# Altium schematic sheet BMduino_test.SchDoc
size A4; SheetNumber: 1; SheetTotal: 1
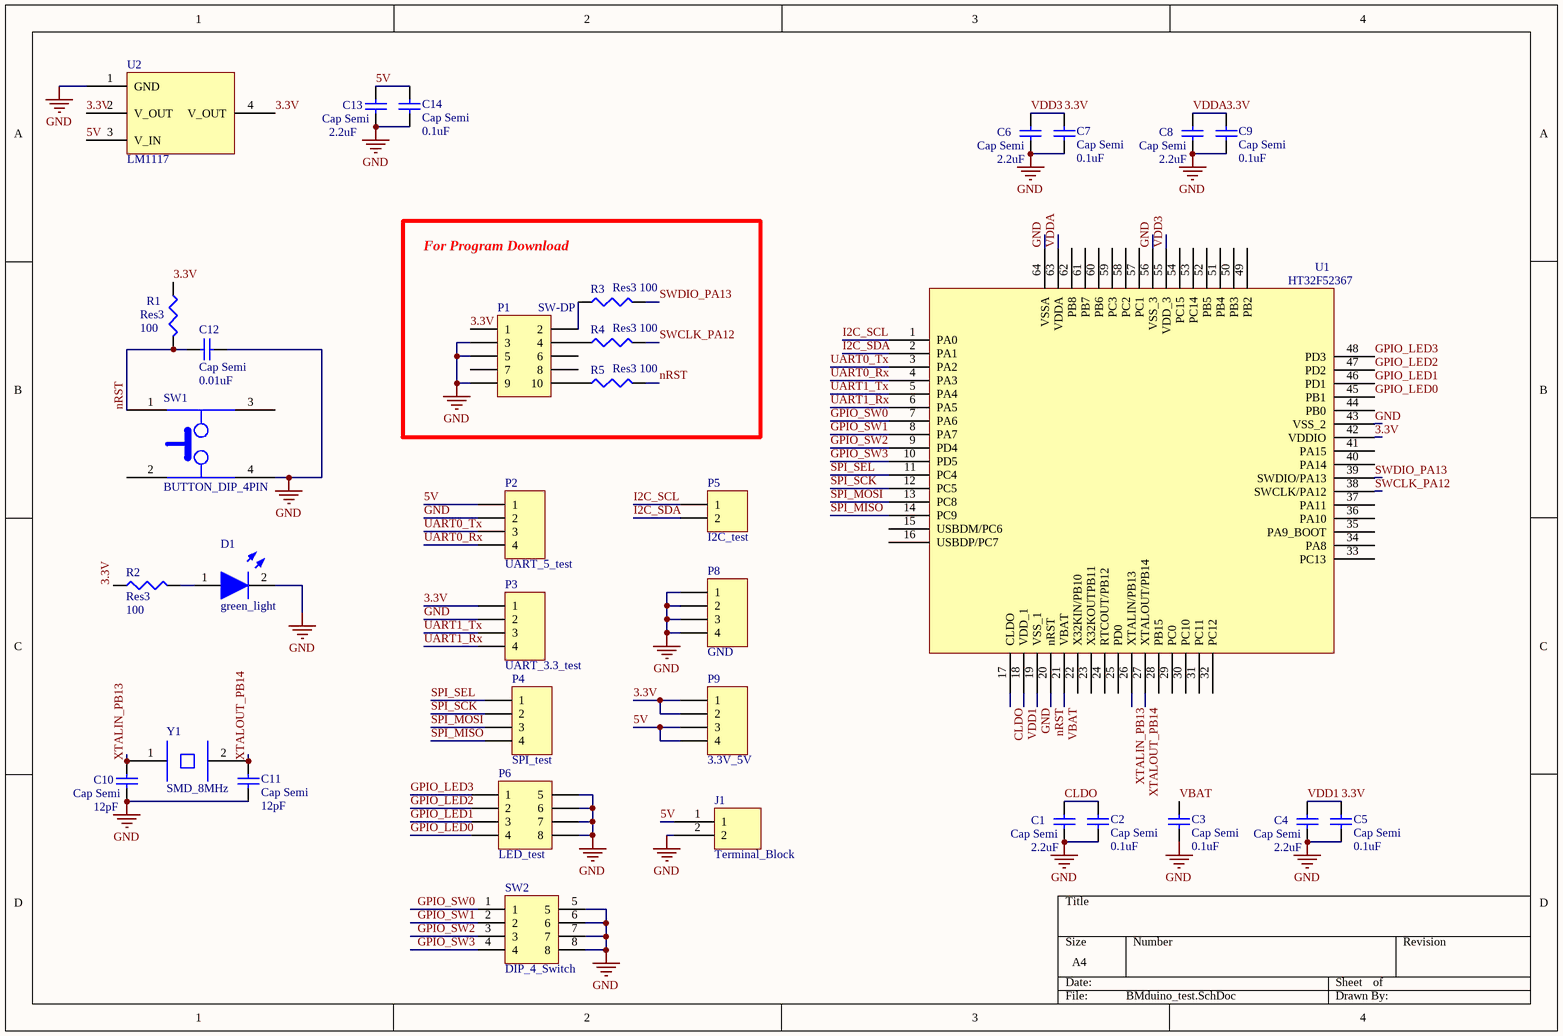
[diagram p0: BMduino_test.SchDoc]

## Parts
C1  Cap Semi  value 2.2uF  [1608[0603]]
C2  Cap Semi  value 0.1uF  [1608[0603]]
C3  Cap Semi  value 0.1uF  [1608[0603]]
C4  Cap Semi  value 2.2uF  [1608[0603]]
C5  Cap Semi  value 0.1uF  [1608[0603]]
C6  Cap Semi  value 2.2uF  [1608[0603]]
C7  Cap Semi  value 0.1uF  [1608[0603]]
C8  Cap Semi  value 2.2uF  [1608[0603]]
C9  Cap Semi  value 0.1uF  [1608[0603]]
C10  Cap Semi  value 12pF  [1608[0603]]
C11  Cap Semi  value 12pF  [1608[0603]]
C12  Cap Semi  value 0.01uF  [1608[0603]]
C13  Cap Semi  value 2.2uF  [1608[0603]]
C14  Cap Semi  value 0.1uF  [1608[0603]]
D1  green_light  [LED_Green]
J1  Terminal_Block  [terminal block]
P1  SW-DP  [HDR2X5]
P2  UART_5_test  [HDR1X4]
P3  UART_3.3_test  [HDR1X4]
P4  SPI_test  [HDR1X4]
P5  I2C_test  [HDR1X2]
P6  LED_test  [HDR2X4_CEN]
P8  GND  [HDR1X4]
P9  3.3V_5V  [HDR1X4]
R1  Res3  value 100  [J1-0603]
R2  Res3  value 100  [J1-0603]
R3  Res3  value 100  [J1-0603]
R4  Res3  value 100  [J1-0603]
R5  Res3  value 100  [J1-0603]
SW1  BUTTON_DIP_4PIN  [Push_Button]
SW2  DIP_4_Switch  [Switch_4]
U1  HT32F52367  [HT32H52367]
U2  LM1117  [LM1117 - duplicate]
Y1  SMD_8MHz  [Quartz-Crystal-8MHz]

## Blocks framed on the sheet
For Program Download: P1 R3-R5

## Nets
GND: C1.2 C2.1 C3.1 C4.2 C5.1 C6.2 C7.1 C8.2 C9.1 C10.2 C11.1 C12.1 C13.2 C14.1 D1.2 J1.2 P1.3 P1.5 P1.9 P2.2 P3.2 P6.5 P6.6 P6.7 P6.8 P8.1 P8.2 P8.3 P8.4 SW1.4 SW2.5 SW2.6 SW2.7 SW2.8 U1.19(VSS_1) U1.43(VSS_2) U1.56(VSS_3) U1.64(VSSA) U2.1(GND)
3.3V: C4.1 C5.2 C6.1 C7.2 C8.1 C9.2 P1.1 P3.1 P9.1 P9.2 R1.1 R2.1 U1.18(VDD_1) U1.42(VDDIO) U1.55(VDD_3) U1.63(VDDA) U2.2(V_OUT) U2.4(V_OUT)  [also labelled VDD1, VDD3, VDDA]
5V: C13.1 C14.2 J1.1 P2.1 P9.3 P9.4 U2.3(V_IN)
CLDO: C1.1 C2.2 U1.17(CLDO)
GPIO_LED0: P6.4 U1.45(PB1)
GPIO_LED1: P6.3 U1.46(PD1)
GPIO_LED2: P6.2 U1.47(PD2)
GPIO_LED3: P6.1 U1.48(PD3)
GPIO_SW0: SW2.1 U1.7(PA6)
GPIO_SW1: SW2.2 U1.8(PA7)
GPIO_SW2: SW2.3 U1.9(PD4)
GPIO_SW3: SW2.4 U1.10(PD5)
I2C_SCL: P5.1 U1.1(PA0)
I2C_SDA: P5.2 U1.2(PA1)
nRST: C12.2 R1.2 R5.2 SW1.1 U1.20(nRST)
SPI_MISO: P4.4 U1.14(PC9)
SPI_MOSI: P4.3 U1.13(PC8)
SPI_SCK: P4.2 U1.12(PC5)
SPI_SEL: P4.1 U1.11(PC4)
SWCLK_PA12: R4.2 U1.38(SWCLK/PA12)
SWDIO_PA13: R3.2 U1.39(SWDIO/PA13)
UART0_Rx: P2.4 U1.4(PA3)
UART0_Tx: P2.3 U1.3(PA2)
UART1_Rx: P3.4 U1.6(PA5)
UART1_Tx: P3.3 U1.5(PA4)
VBAT: C3.2 U1.21(VBAT)
XTALIN_PB13: C10.1 U1.26(XTALIN/PB13) Y1.1
XTALOUT_PB14: C11.2 U1.27(XTALOUT/PB14) Y1.2
NetD1_1: D1.1 R2.2
NetP1_2: P1.2 R3.1
NetP1_4: P1.4 R4.1
NetP1_10: P1.10 R5.1

Not connected (* = marked no-connect by the designer): P1 6 7 8; SW1 2 3; U1 15(USBDM/PC6) 16(USBDP/PC7) 22(X32KIN/PB10) 23(X32KOUTPB11) 24(RTCOUT/PB12) 25(PD0) 28(PB15) 29(PC0) 30(PC10) 31(PC11) 32(PC12) 33(PC13) 34(PA8) 35(PA9_BOOT) 36(PA10) 37(PA11) 40(PA14) 41(PA15) 44(PB0) 49(PB2) 50(PB3) 51(PB4) 52(PB5) 53(PC14) 54(PC15) 57(PC1) 58(PC2) 59(PC3) 60(PB6) 61(PB7) 62(PB8)

## Library data of the parts
C1-C14 = Cap Semi: Capacitor (Semiconductor SIM Model); Published: 8-Jun-2000; LatestRevisionDate: 29-May-2009; LatestRevisionNote: IPC-7351 Footprint Added.; PackageReference: C1206; Publisher: Altium Limited; PackageDescription: Chip Capacitor
D1 = LED_Green
J1 = Terminal Block
P1 = Header 5X2: Header, 5-Pin, Dual row; LatestRevisionDate: 17-Jul-2002; LatestRevisionNote: Re-released for DXP Platform.; Publisher: Altium Limited
P2-P4 P8 P9 = Header 4: Header, 4-Pin; LatestRevisionDate: 17-Jul-2002; LatestRevisionNote: Re-released for DXP Platform.; Publisher: Altium Limited
P5 = Header 2: Header, 2-Pin; LatestRevisionDate: 17-Jul-2002; LatestRevisionNote: Re-released for DXP Platform.; Publisher: Altium Limited
P6 = Header 4X2A: Header, 4-Pin, Dual row; LatestRevisionDate: 17-Jul-2002; LatestRevisionNote: Re-released for DXP Platform.; Publisher: Altium Limited
R1-R5 = Res3: Resistor; Published: 8-Jun-2000; LatestRevisionDate: 29-May-2009; LatestRevisionNote: IPC-7351 Footprint Added.; PackageReference: J1-0603; Publisher: Altium Limited; PackageDescription: Chip Resistor
SW1 = Push_Button
SW2 = Switch_4
Y1 = Quartz_Crystal_8MHz